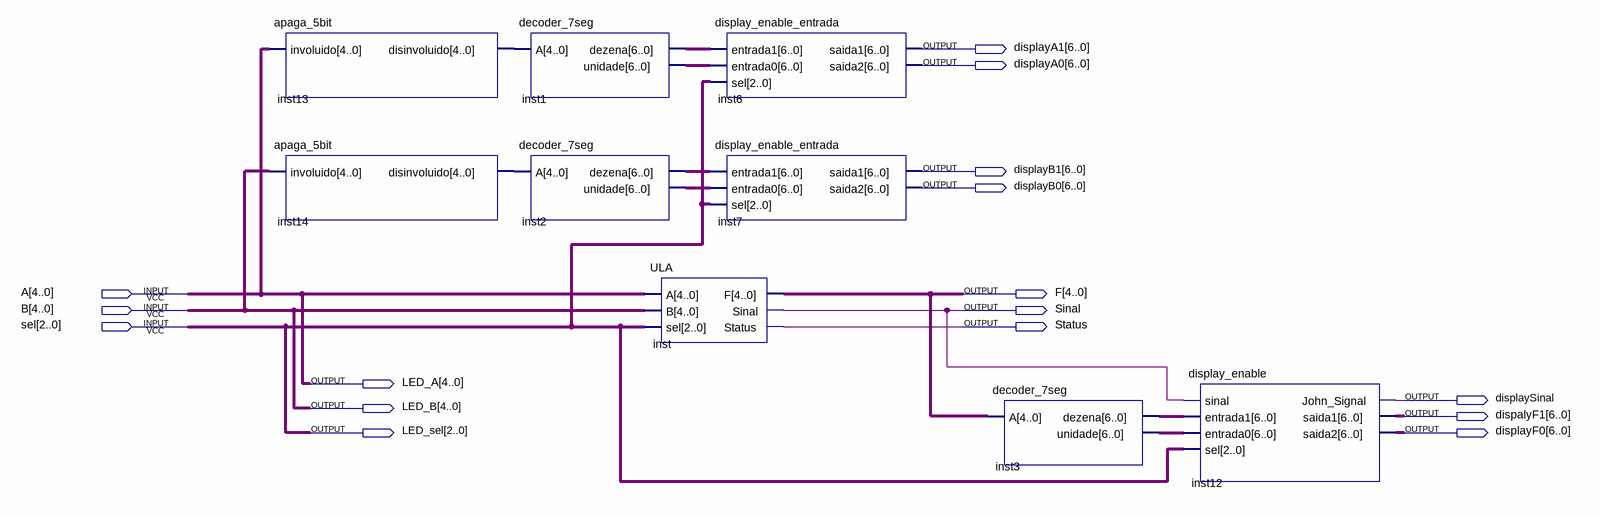
[diagram p0: schematic sheet]
// Quartus schematic circuitoPrincipal.bdf as structural Verilog: 9 symbols, 16 pins
module circuitoPrincipal (
  input  [4:0] A,
  input  [4:0] B,
  input  [2:0] sel,
  output [6:0] displayA1,
  output [6:0] displayA0,
  output [6:0] displayB1,
  output [6:0] displayB0,
  output [4:0] F,
  output Sinal,
  output Status,
  output [4:0] LED_A,
  output displaySinal,
  output [4:0] LED_B,
  output [6:0] dispalyF1,
  output [2:0] LED_sel,
  output [6:0] displayF0
);

  wire [4:0] inst13_disinvoluido, inst14_disinvoluido;
  wire [6:0] inst1_dezena, inst1_unidade, inst2_dezena, inst2_unidade, inst3_dezena, inst3_unidade;

  apaga_5bit inst13 (.involuido(A), .disinvoluido(inst13_disinvoluido));
  apaga_5bit inst14 (.involuido(B), .disinvoluido(inst14_disinvoluido));
  decoder_7seg inst1 (.A(inst13_disinvoluido), .dezena(inst1_dezena), .unidade(inst1_unidade));
  decoder_7seg inst2 (.A(inst14_disinvoluido), .dezena(inst2_dezena), .unidade(inst2_unidade));
  ULA inst (.A(A), .B(B), .sel(sel), .F(F), .Sinal(Sinal), .Status(Status));
  display_enable_entrada inst6 (
    .entrada1(inst1_dezena), .entrada0(inst1_unidade), .sel(sel), .saida1(displayA1), .saida2(displayA0));
  display_enable_entrada inst7 (
    .entrada1(inst2_dezena), .entrada0(inst2_unidade), .sel(sel), .saida1(displayB1), .saida2(displayB0));
  decoder_7seg inst3 (.A(F), .dezena(inst3_dezena), .unidade(inst3_unidade));
  display_enable inst12 (
    .sinal(Sinal), .entrada1(inst3_dezena), .entrada0(inst3_unidade), .sel(sel), .John_Signal(displaySinal),
    .saida1(dispalyF1), .saida2(displayF0));

  assign LED_A = A;
  assign LED_B = B;
  assign LED_sel = sel;
endmodule
